# Altium schematic sheet USB.SchDoc
size A4
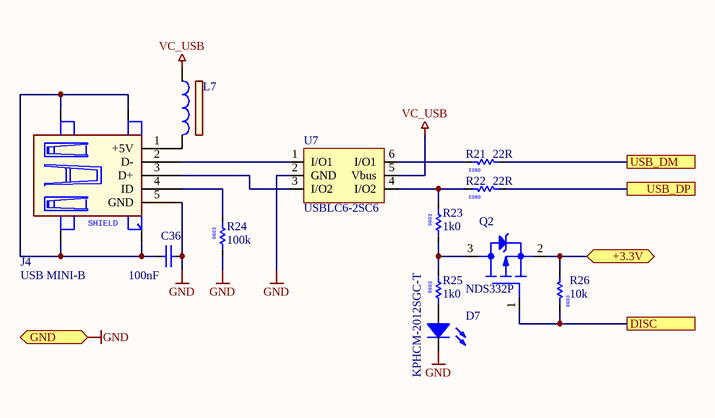
[diagram p0: USB.SchDoc]

## Parts
C36  100nF  [C0603V]
D7  KPHCM-2012SGC-T  [D0805]
J4  USB MINI-B  [MOLEX_MINI_USB-B]
L7  (no value)  [LL0805\2P]
Q2  NDS332P  [SOT23-3L]
R21  22R  [RESC1608N]
R22  22R  [RESC1608N]
R23  1k0  [RESC1608N]
R24  100k  [RESC1608N]
R25  1k0  [RESC1608N]
R26  10k  [RESC1608N]
U7  USBLC6-2SC6  [SOT95P280X145-6N]

## Ports
+3.3V, DISC, GND, USB_DM, USB_DP

## Nets
GND: C36.1 D7.2 J4.5(GND) R24.1 U7.2(GND) ; port GND
VC_USB: L7.1 U7.5(Vbus)
+3.3V: Q2.2(S) R26.2 ; port +3.3V
DISC: Q2.1(G) R26.1 ; port DISC
USB_DM: R21.2 ; port USB_DM
USB_DP: R22.2 ; port USB_DP
NetC36_2: C36.2 J4.6(SHIELD) J4.7(SHIELD) J4.8(SHIELD) J4.9(SHIELD)
NetD7_1: D7.1 R25.1
NetJ4_1: J4.1(+5V) L7.2
NetJ4_2: J4.2(D-) U7.1(I/O1)
NetJ4_3: J4.3(D+) U7.3(I/O2)
NetJ4_4: J4.4(ID) R24.2
NetQ2_3: Q2.3(D) R23.1 R25.2
NetR21_1: R21.1 U7.6(I/O1)
NetR22_1: R22.1 R23.2 U7.4(I/O2)

## Notes on the sheet
- (in symbol R0000006) 0603
- (in symbol R0000008) 0603
- (in symbol R2406032) 0603
- (in symbol R2406120) 0603

## Library data of the parts
C36 = C0000005: MLCC, 0.1uF 16V 10% X7R 0603; Manufacturer: KEMET; Manufacturer Part Number: C0603C104K4RACTU; Voltage: 16; Project: AUT-RX03-00; Note: 0,041 €; Part Number: C0000005; Part Type: MLCC; Tolerance: 10%; Material: X7R; Package: 0603 (1608 metric); SMD: Yes; Supplier 1: Farnell; Supplier Part Number 1: 1414610RL; Supplier 2: Mouser; Supplier Part Number 2: 80-C0603C104K4R; ComponentLink1Description: MFG link; ComponentLink1URL: http://www.kemet.com/datasheets&C0603C104K4RACTU; Data: 2011.02.27
D7 = D0000030: LED, SMD, 0805, GREEN, 25mcd; Manufacturer: KINGBRIGHT; Vforvard: 2.5; Current: 20mA; Project: Zhilinskas_I/II/III; Note: S; Part Number: D0000030; Part Type: Diode\LED; Rating: 25 mcd; SMD: Yes; Manufacturer Part Number: KPHCM-2012SGC-T; ComponentLink1Description: MFG link; ComponentLink1URL: http://www.kingbright-europe.de/_daten/KPHCM-2012SGC-T(Ver.3).pdf; ComponentLink2Description: DataSheet; Data: 2011.09.15; Supplier 1: Farnell; Supplier Part Number 1: 1686074; Supplier 2: Mouser; Supplier Part Number 2: 859-LTST-C171CKT
J4 = J0000002: USB MINI-B SMT connector; Manufacturer: Molex; Manufacturer Part Number: 675031020; Gender: Receptacle; 3D Model: SW3dPS-USB_mini_B; Project: PSP500; Part Number: J0000002; Part Type: Connector\USB; Orientation: RA; SMD: Yes; Supplier 1: Farnell; Supplier Part Number 1: 1125348; Price: 5,39; Supplier 2: Mouser; Supplier Part Number 2: 538-67503-1020; ComponentLink1Description: MFG link; ComponentLink1URL: http://www.molex.com/pdm_docs/sd/675031020_sd.pdf; ComponentLink2Description: USB.pdf; ComponentLink2URL: \\193.219.36.50\nescafe\Altium Database\KTU340DB\PDF\Connector\USB\675031020_sd.pdf; Qty: 5; Data: 2011.01.28
L7 = L0000002: BEAD SMD EMI FERRITE 0805 220 OHM; Manufacturer: Murata; Manufacturer Part Number: BLM21PG221SN1D; Resistance: 220 OHM; Part Number: L0000002; Part Type: Ferrite\Bead; SMD: Yes; ComponentLink1Description: MFG link; ComponentLink2Description: DataSheet; Data: 2011-01-26
Q2 = Q0000046: P-Channel Logic Level Enhancement Mode Field Effect Transistor; Manufacturer: FAIRCHILD SEMICONDUCTOR; Vds: -20V; RdsON: 300mΩ; Id: 1A; Part Number: Q0000046; Part Type: MOSFET\P-CH; SMD: Yes; Manufacturer Part Number: NDS332P; Supplier 1: Farnell; Supplier Part Number 1: 1471069; Supplier 2: Mouser; Supplier Part Number 2: 512-NDS332P; ComponentLink1Description: MFG link; ComponentLink1URL: http://www.fairchildsemi.com/ds/ND/NDS332P.pdf; ComponentLink2Description: Datasheet MFG; Qty: 3; Data: 2012.02.20
R21 R22 = R2406032: Res, 22R 5% 0603 1/10W; Manufacturer: MULTICOMP; Manufacturer Part Number: MC0063W0603122R; Supplier 1: Farnell; Supplier Part Number 1: 9330844; Supplier 2: Mouser; Supplier Part Number 2: 660-RK73H1JTTD22R0F; Part type: Carbon Film; Tolerance: ±5%; Power: 1/10W; Package: 0603 (1608 metric); SMD: Yes; Data: 2011.01.31; R2408042: R2406032
R23 R25 = R0000006: Res, thin film 1k  ±5% 0.1W 0603; Manufacturer: MULTICOMP; Manufacturer Part Number: MCMR06X102 JTL; Project: AUT-RX03-00; Note: 0,083 €; R2408042: R0000006; Part type: Thin Film; Tolerance: ±5%; Power: 0.1W; Package: 0603 (1608 metric); SMD: Yes; Supplier 1: Farnell; Supplier Part Number 1: 2073354; Supplier 2: Mouser; Supplier Part Number 2: 71-TNPW06031K00DEEA; ComponentLink1Description: Datasheet MFG; ComponentLink1URL: http://www.vishay.com./doc?28758; Data: 2011.02.28
R24 = R2406120: Res, 100K 5% 0603 1/10W; Manufacturer: YAGEO; Manufacturer Part Number: RC0603FR-13100KL; Tolerance: ±1%; R2408042: R2406120; Part type: Carbon Film; Power: 1/10W; Package: 0603 (1608 metric); SMD: Yes; Supplier 1: Farnell; Supplier Part Number 1: 2309107; Supplier 2: Mouser; Supplier Part Number 2: 603-RC0603FR-13100KL; Data: 2011.01.31
R26 = R0000008: Res, 10K 0.063W 75V 1%  0603; Manufacturer: MULTICOMP; Manufacturer Part Number: MCMR06X1002FTL; Project: AUT-RX03-00; Note: 0,033 €; R2408042: R0000008; Part type: Thick Film; Tolerance: ±1%; Power: 0.063W; Package: 0603 (1608 metric); SMD: Yes; Supplier 1: Farnell; Supplier Part Number 1: 2073349; Supplier 2: Mouser; Supplier Part Number 2: 594-MCT06030C1002FP5; ComponentLink1Description: Datasheet MFG; ComponentLink1URL: http://www.vishay.com/doc?28705; Data: 2011.02.28
U7 = D0000115: DIODE ARRAY, TVS, USB2; Manufacturer: STMICROELECTRONICS; Part Number: D0000115; Part Type: Diode\TVS; SMD: Yes; Manufacturer Part Number: USBLC6-2SC6; ComponentLink1Description: MFG link; ComponentLink1URL: http://www.farnell.com/datasheets/1690354.pdf; Data: 2016.03.08; Supplier 1: Farnell; Supplier Part Number 1: 1269406